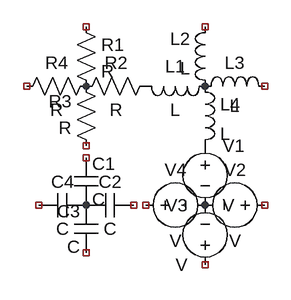
[diagram p0: schematic Draft4.asc]
Draft4.asc, the LTspice schematic file:
Version 4
SHEET 1 880 688
SYMBOL res -176 192 R0
SYMATTR InstName R1
SYMBOL res -64 272 R90
WINDOW 0 0 56 VBottom 2
WINDOW 3 32 56 VTop 2
SYMATTR InstName R2
SYMBOL res -144 384 R180
WINDOW 0 36 76 Left 2
WINDOW 3 36 40 Left 2
SYMATTR InstName R3
SYMBOL res -256 304 R270
WINDOW 0 32 56 VTop 2
WINDOW 3 0 56 VBottom 2
SYMATTR InstName R4
SYMBOL ind 16 272 R90
WINDOW 0 5 56 VBottom 2
WINDOW 3 32 56 VTop 2
SYMATTR InstName L1
SYMBOL ind 16 304 R180
WINDOW 0 36 80 Left 2
WINDOW 3 36 40 Left 2
SYMATTR InstName L2
SYMBOL ind -16 304 R270
WINDOW 0 32 56 VTop 2
WINDOW 3 5 56 VBottom 2
SYMATTR InstName L3
SYMBOL ind -16 272 R0
SYMATTR InstName L4
SYMBOL voltage 0 352 R0
SYMATTR InstName V1
SYMBOL voltage 96 448 R90
WINDOW 0 -32 56 VBottom 2
WINDOW 3 32 56 VTop 2
SYMATTR InstName V2
SYMBOL voltage 0 544 R180
WINDOW 0 24 96 Left 2
WINDOW 3 24 16 Left 2
SYMATTR InstName V3
SYMBOL voltage -96 448 R270
WINDOW 0 32 56 VTop 2
WINDOW 3 -32 56 VBottom 2
SYMATTR InstName V4
SYMBOL cap -176 384 R0
SYMATTR InstName C1
SYMBOL cap -96 432 R90
WINDOW 0 0 32 VBottom 2
WINDOW 3 32 32 VTop 2
SYMATTR InstName C2
SYMBOL cap -144 512 R180
WINDOW 0 24 56 Left 2
WINDOW 3 24 8 Left 2
SYMATTR InstName C3
SYMBOL cap -224 464 R270
WINDOW 0 32 32 VTop 2
WINDOW 3 0 32 VBottom 2
SYMATTR InstName C4

The netlist it stands for:
* Draft4.asc
R1 NC_01 P001 R
R2 P002 P001 R
R3 NC_02 P001 R
R4 NC_03 P001 R
L1 P003 P002 L
L2 P003 NC_04 L
L3 P003 NC_05 L
L4 P003 P004 L
V1 P004 P005 V
V2 NC_06 P005 V
V3 NC_07 P005 V
V4 NC_08 P005 V
C1 NC_09 P006 C
C2 NC_10 P006 C
C3 NC_11 P006 C
C4 NC_12 P006 C
.backanno
.end